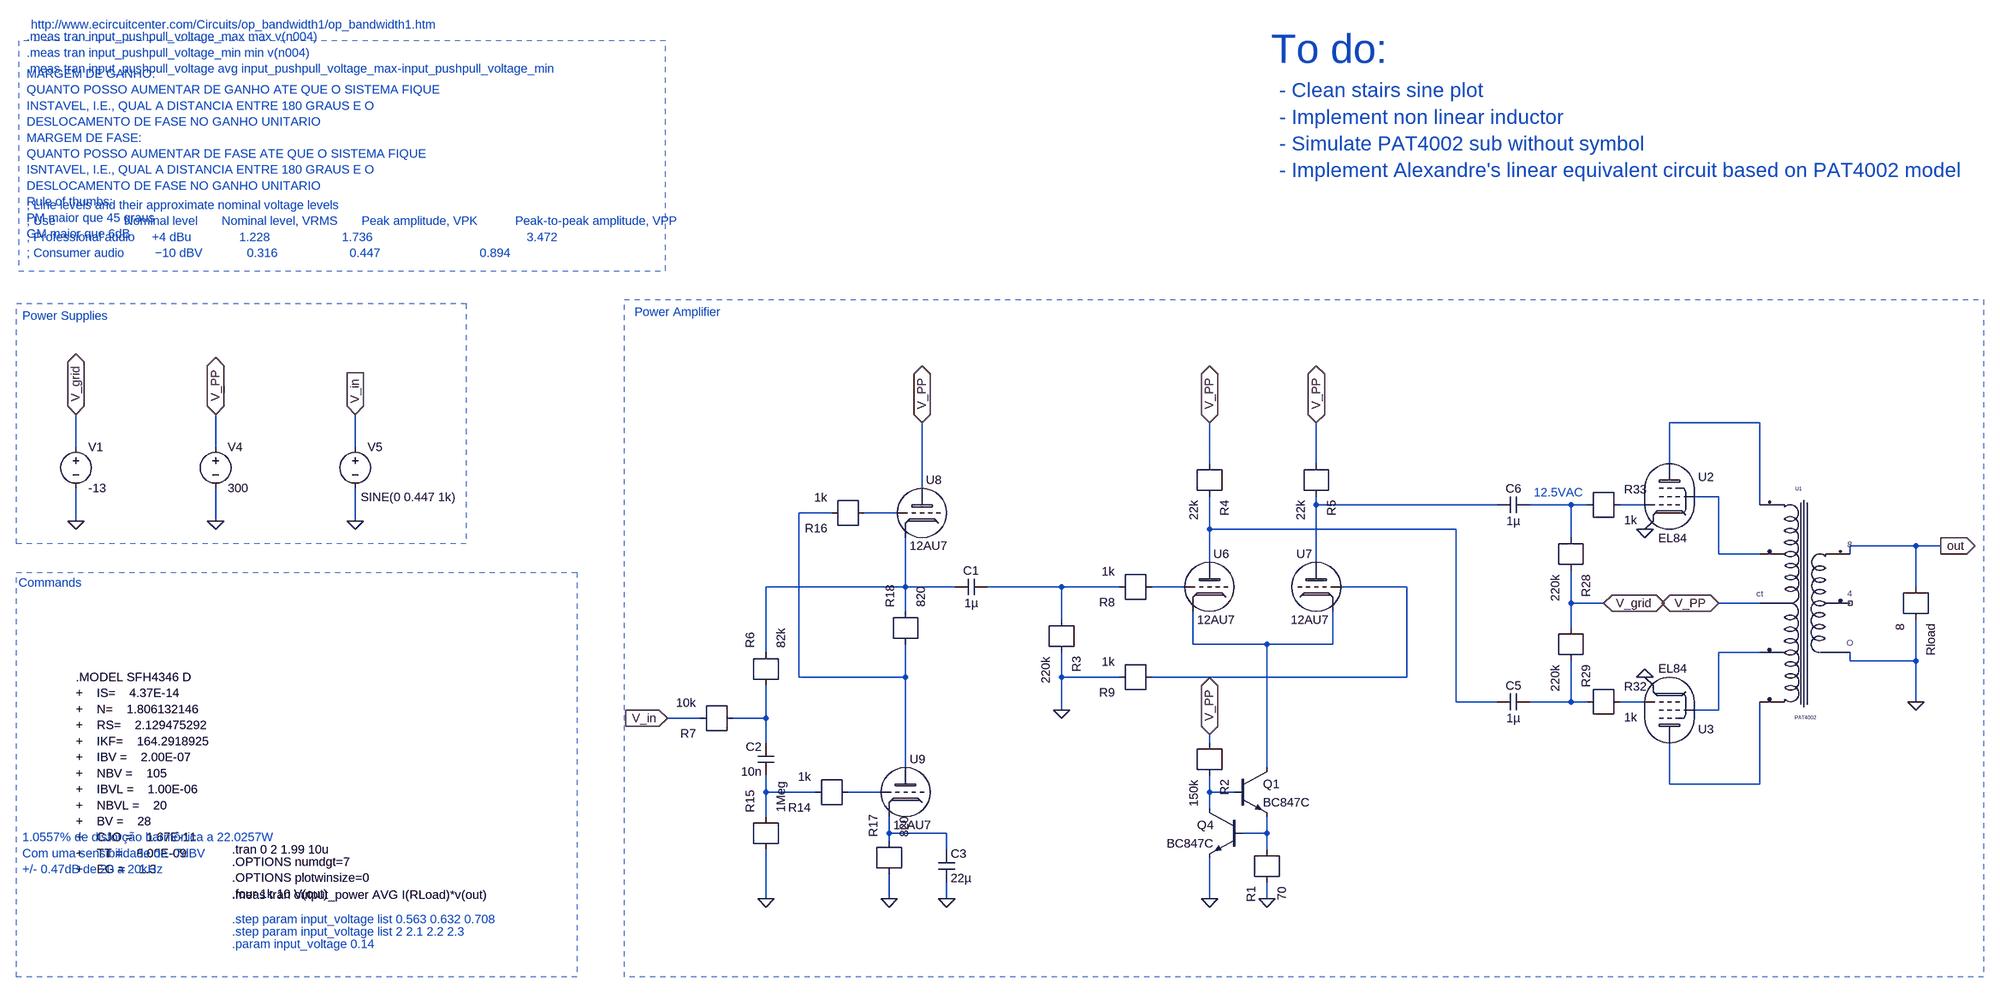
[diagram p0: schematic POWER_AMP_IC_rework_el84_transient_sine.asc]
POWER_AMP_IC_rework_el84_transient_sine.asc, the LTspice schematic file:
Version 4
SHEET 1 2188 1388
WIRE 912 -1200 736 -1200
WIRE -2368 -1152 -2368 -1216
WIRE -2096 -1152 -2096 -1216
WIRE -1824 -1152 -1824 -1216
WIRE -160 -1120 -160 -1200
WIRE 48 -1120 48 -1200
WIRE 736 -1120 736 -1200
WIRE -720 -1072 -720 -1200
WIRE 832 -1056 784 -1056
WIRE 48 -1040 48 -1056
WIRE 400 -1040 48 -1040
WIRE 544 -1040 464 -1040
WIRE 576 -1040 544 -1040
WIRE 688 -1040 640 -1040
WIRE 912 -1040 912 -1200
WIRE -896 -1024 -960 -1024
WIRE -768 -1024 -832 -1024
WIRE -2368 -1008 -2368 -1072
WIRE -2096 -1008 -2096 -1072
WIRE -1824 -1008 -1824 -1072
WIRE -160 -992 -160 -1056
WIRE 320 -992 -160 -992
WIRE 544 -976 544 -1040
WIRE 1216 -960 1088 -960
WIRE 1264 -960 1216 -960
WIRE 832 -944 832 -1056
WIRE 912 -944 832 -944
WIRE 1088 -944 1088 -960
WIRE -160 -928 -160 -992
WIRE 48 -928 48 -1040
WIRE -752 -880 -752 -976
WIRE -752 -880 -1024 -880
WIRE -656 -880 -752 -880
WIRE -448 -880 -592 -880
WIRE -336 -880 -448 -880
WIRE -208 -880 -272 -880
WIRE 224 -880 96 -880
WIRE 1216 -880 1216 -960
WIRE 544 -848 544 -912
WIRE 608 -848 544 -848
WIRE 912 -848 832 -848
WIRE -752 -832 -752 -880
WIRE -448 -816 -448 -880
WIRE 544 -800 544 -848
WIRE -192 -768 -192 -832
WIRE -48 -768 -192 -768
WIRE 80 -768 80 -832
WIRE 80 -768 -48 -768
WIRE -1024 -752 -1024 -880
WIRE 912 -752 832 -752
WIRE 1088 -736 1088 -752
WIRE 1216 -736 1216 -816
WIRE 1216 -736 1088 -736
WIRE -960 -704 -960 -1024
WIRE -752 -704 -752 -768
WIRE -752 -704 -960 -704
WIRE -448 -704 -448 -752
WIRE -336 -704 -448 -704
WIRE 224 -704 224 -880
WIRE 224 -704 -272 -704
WIRE 320 -656 320 -992
WIRE 400 -656 320 -656
WIRE 544 -656 544 -736
WIRE 544 -656 464 -656
WIRE 576 -656 544 -656
WIRE 688 -656 640 -656
WIRE 1216 -656 1216 -736
WIRE -448 -640 -448 -704
WIRE 832 -640 832 -752
WIRE 832 -640 784 -640
WIRE -1152 -624 -1216 -624
WIRE -1024 -624 -1024 -688
WIRE -1024 -624 -1088 -624
WIRE -1024 -576 -1024 -624
WIRE -160 -576 -160 -592
WIRE -752 -528 -752 -704
WIRE -48 -528 -48 -768
WIRE 736 -496 736 -576
WIRE 912 -496 912 -656
WIRE 912 -496 736 -496
WIRE -1024 -480 -1024 -512
WIRE -928 -480 -1024 -480
WIRE -800 -480 -864 -480
WIRE -160 -480 -160 -512
WIRE -112 -480 -160 -480
WIRE -160 -448 -160 -480
WIRE -1024 -432 -1024 -480
WIRE -784 -400 -784 -432
WIRE -672 -400 -784 -400
WIRE -48 -400 -48 -432
WIRE -48 -400 -96 -400
WIRE -784 -384 -784 -400
WIRE -672 -368 -672 -400
WIRE -48 -368 -48 -400
WIRE -1024 -272 -1024 -368
WIRE -784 -272 -784 -320
WIRE -672 -272 -672 -304
WIRE -160 -272 -160 -352
WIRE -48 -272 -48 -304
FLAG -1824 -1008 0
FLAG -2096 -1008 0
FLAG -2368 -1008 0
FLAG -2368 -1216 V_grid
IOPIN -2368 -1216 BiDir
FLAG 688 -992 0
FLAG 688 -704 0
FLAG 608 -848 V_grid
IOPIN 608 -848 BiDir
FLAG 1216 -656 0
FLAG 1264 -960 out
IOPIN 1264 -960 Out
FLAG -2096 -1216 V_PP
IOPIN -2096 -1216 BiDir
FLAG 832 -848 V_PP
IOPIN 832 -848 BiDir
FLAG -448 -640 0
FLAG -1216 -624 V_in
IOPIN -1216 -624 In
FLAG -1024 -272 0
FLAG -784 -272 0
FLAG -48 -272 0
FLAG -160 -272 0
FLAG -160 -592 V_PP
IOPIN -160 -592 BiDir
FLAG 48 -1200 V_PP
IOPIN 48 -1200 BiDir
FLAG -160 -1200 V_PP
IOPIN -160 -1200 BiDir
FLAG -720 -1200 V_PP
IOPIN -720 -1200 BiDir
FLAG -672 -272 0
FLAG -1824 -1216 V_in
IOPIN -1824 -1216 In
SYMBOL voltage -2096 -1168 R0
SYMATTR InstName V4
SYMATTR Value 300
SYMBOL voltage -1824 -1168 R0
WINDOW 3 11 113 Left 2
SYMATTR Value SINE(0 0.447 1k)
SYMATTR InstName V5
SYMATTR Value2 AC 1
SYMBOL voltage -2368 -1168 R0
SYMATTR InstName V1
SYMATTR Value -13
SYMBOL r 544 -976 R90
SYMATTR InstName R28
SYMATTR Value 220k
SYMBOL r 544 -800 R90
SYMATTR InstName R29
SYMATTR Value 220k
SYMBOL r 576 -656 R0
SYMATTR InstName R32
SYMATTR Value 1k
SYMBOL r 576 -1040 R0
SYMATTR InstName R33
SYMATTR Value 1k
SYMBOL cap 464 -672 R90
WINDOW 0 0 32 VBottom 2
WINDOW 3 32 32 VTop 2
SYMATTR InstName C5
SYMATTR Value 1µ
SYMBOL cap 464 -1056 R90
WINDOW 0 0 32 VBottom 2
WINDOW 3 32 32 VTop 2
SYMATTR InstName C6
SYMATTR Value 1µ
SYMBOL r 1216 -880 R90
SYMATTR InstName Rload
SYMATTR Value 8
SYMBOL Trafos/PAT4002 992 -848 R0
SYMATTR InstName U1
SYMBOL Tubes/EL84 736 -1056 R0
SYMATTR InstName U2
SYMBOL Tubes/EL84 736 -640 M180
SYMATTR InstName U3
SYMBOL npn -112 -528 R0
SYMATTR InstName Q1
SYMATTR Value BC847C
SYMBOL npn -96 -448 M0
SYMATTR InstName Q4
SYMATTR Value BC847C
SYMBOL r -48 -368 M90
SYMATTR InstName R1
SYMATTR Value 70
SYMBOL r -160 -576 R90
SYMATTR InstName R2
SYMATTR Value 150k
SYMBOL r -448 -816 R90
SYMATTR InstName R3
SYMATTR Value 220k
SYMBOL r -160 -1120 R90
SYMATTR InstName R4
SYMATTR Value 22k
SYMBOL r 48 -1120 R90
SYMATTR InstName R5
SYMATTR Value 22k
SYMBOL 12AU7 -160 -880 R0
SYMATTR InstName U6
SYMBOL 12AU7 48 -880 M0
SYMATTR InstName U7
SYMBOL cap -592 -896 R90
WINDOW 0 0 32 VBottom 2
WINDOW 3 32 32 VTop 2
SYMATTR InstName C1
SYMATTR Value 1µ
SYMBOL r -272 -880 R180
SYMATTR InstName R8
SYMATTR Value 1k
SYMBOL r -272 -704 R180
SYMATTR InstName R9
SYMATTR Value 1k
SYMBOL r -864 -480 R180
SYMATTR InstName R14
SYMATTR Value 1k
SYMBOL r -1024 -368 R270
SYMATTR InstName R15
SYMATTR Value 1Meg
SYMBOL r -832 -1024 R180
SYMATTR InstName R16
SYMATTR Value 1k
SYMBOL r -784 -320 R270
SYMATTR InstName R17
SYMATTR Value 820
SYMBOL r -752 -768 R270
SYMATTR InstName R18
SYMATTR Value 820
SYMBOL 12AU7 -720 -1024 R0
SYMATTR InstName U8
SYMBOL 12AU7 -752 -480 R0
SYMATTR InstName U9
SYMBOL r -1024 -688 R270
SYMATTR InstName R6
SYMATTR Value 82k
SYMBOL cap -1008 -576 M0
SYMATTR InstName C2
SYMATTR Value 10n
SYMBOL r -1088 -624 R180
SYMATTR InstName R7
SYMATTR Value 10k
SYMBOL cap -688 -368 R0
SYMATTR InstName C3
SYMATTR Value 22µ
TEXT -2064 -344 Left 2 !.OPTIONS numdgt=7\n.OPTIONS plotwinsize=0\n.four 1k 10 V(out)
TEXT -2368 -704 Left 2 !.MODEL SFH4346 D	\n+	IS=	4.37E-14\n+	N=	1.806132146\n+	RS=	2.129475292\n+	IKF=	164.2918925\n+	IBV =	2.00E-07\n+	NBV =	105\n+	IBVL =	1.00E-06\n+	NBVL =	20\n+	BV =	28\n+	CJO =	1.67E-11\n+	TT =	8.00E-09\n+	EG =	1.3
TEXT -2480 -888 Left 2 ;Commands
TEXT -2472 -1408 Left 2 ;Power Supplies
TEXT -2464 -1880 Left 2 ;MARGEM DE GANHO:\nQUANTO POSSO AUMENTAR DE GANHO ATE QUE O SISTEMA FIQUE\nINSTAVEL, I.E., QUAL A DISTANCIA ENTRE 180 GRAUS E O \nDESLOCAMENTO DE FASE NO GANHO UNITARIO\nMARGEM DE FASE:\nQUANTO POSSO AUMENTAR DE FASE ATE QUE O SISTEMA FIQUE \nISNTAVEL, I.E., QUAL A DISTANCIA ENTRE 180 GRAUS E O \nDESLOCAMENTO DE FASE NO GANHO UNITARIO\nRule of thumbs:\nPM maior que 45 graus\nGM maior que 6dB
TEXT -1280 -1416 Left 2 ;Power Amplifier
TEXT -2064 -280 Left 2 !.meas tran output_power AVG I(RLoad)*v(out)
TEXT -2064 -232 Left 2 ;.step param input_voltage list 0.563 0.632 0.708
TEXT -2472 -392 Left 2 ;1.0557% de distorção harmônica a 22.0257W\nCom uma sensibilidade de -7dBV\n+/- 0.47dB de 20 a 20kHz
TEXT -2064 -208 Left 2 ;.step param input_voltage list 2 2.1 2.2 2.3
TEXT -2064 -184 Left 2 ;.param input_voltage 0.14
TEXT -2464 -1624 Left 2 ;; Line levels and their approximate nominal voltage levels\n; Use                	Nominal level   	Nominal level, VRMS   	Peak amplitude, VPK   		Peak-to-peak amplitude, VPP\n; Professional audio 	+4 dBu          	1.228                 	1.736                 							3.472\n; Consumer audio     	−10 dBV         	0.316                 	0.447                 			0.894
TEXT -2464 -1952 Left 2 ;.meas tran input_pushpull_voltage_max max v(n004)\n.meas tran input_pushpull_voltage_min min v(n004)\n.meas tran input_pushpull_voltage avg input_pushpull_voltage_max-input_pushpull_voltage_min
TEXT 472 -1064 Left 2 ;12.5VAC
TEXT -2456 -1976 Left 2 ;http://www.ecircuitcenter.com/Circuits/op_bandwidth1/op_bandwidth1.htm
TEXT -2064 -368 Left 2 !.tran 0 2 1.99 10u
TEXT -40 -1928 Left 6 ;To do:
TEXT -24 -1848 Left 4 ;- Clean stairs sine plot\n- Implement non linear inductor\n- Simulate PAT4002 sub without symbol\n- Implement Alexandre's linear equivalent circuit based on PAT4002 model
RECTANGLE Normal -2484 -908 -1392 -120 2
RECTANGLE Normal -2484 -1432 -1608 -964 2
RECTANGLE Normal -1300 -1440 1348 -120 2
RECTANGLE Normal -2480 -1496 -1220 -1944 2

The netlist it stands for:
* POWER_AMP_IC_rework_el84_transient_sine.asc
V4 V_PP 0 300
V5 V_in 0 SINE(0 0.447 1k) AC 1
V1 V_grid 0 -13
R28 V_grid N004 220k
R29 N015 V_grid 220k
R32 N016 N015 1k
R33 N005 N004 1k
C5 N015 N008 1µ
C6 N004 N003 1µ
Rload 0 out 8
XU1 N001 N002 V_PP N014 N018 out NC_01 0 PAT4002  ; pins p1 st1 ct st2 p2 8 4 O
XU2 N001 N002 N005 0 EL84  ; pins Placa Grade_Screen Grade_controle Câtodo
XU3 N018 N014 N016 0 EL84  ; pins Placa Grade_Screen Grade_controle Câtodo
Q1 N013 N021 N023 0 BC847C
Q4 N021 N023 0 0 BC847C
R1 0 N023 70
R2 N021 V_PP 150k
R3 0 N010 220k
R4 N008 V_PP 22k
R5 N003 V_PP 22k
XU6 N008 N011 N013 12AU7  ; pins Plate Grid Cathode
XU7 N003 N012 N013 12AU7  ; pins Plate Grid Cathode
C1 N010 N009 1µ
R8 N010 N011 1k
R9 0 N012 1k
R14 N019 N020 1k
R15 N019 0 1Meg
R16 N006 N007 1k
R17 N022 0 820
R18 N009 N006 820
XU8 V_PP N007 N009 12AU7  ; pins Plate Grid Cathode
XU9 N006 N020 N022 12AU7  ; pins Plate Grid Cathode
R6 N009 N017 82k
C2 N017 N019 10n
R7 V_in N017 10k
C3 N022 0 22µ
.model NPN NPN
.model PNP PNP
.lib standard.bjt
.OPTIONS numdgt=7
.OPTIONS plotwinsize=0
.four 1k 10 V(out)
.MODEL SFH4346 D
+	IS=	4.37E-14
+	N=	1.806132146
+	RS=	2.129475292
+	IKF=	164.2918925
+	IBV =	2.00E-07
+	NBV =	105
+	IBVL =	1.00E-06
+	NBVL =	20
+	BV =	28
+	CJO =	1.67E-11
+	TT =	8.00E-09
+	EG =	1.3
* Commands
* Power Supplies
* MARGEM DE GANHO:
* QUANTO POSSO AUMENTAR DE GANHO ATE QUE O SISTEMA FIQUE
* INSTAVEL, I.E., QUAL A DISTANCIA ENTRE 180 GRAUS E O
* DESLOCAMENTO DE FASE NO GANHO UNITARIO
* MARGEM DE FASE:
* QUANTO POSSO AUMENTAR DE FASE ATE QUE O SISTEMA FIQUE
* ISNTAVEL, I.E., QUAL A DISTANCIA ENTRE 180 GRAUS E O
* DESLOCAMENTO DE FASE NO GANHO UNITARIO
* Rule of thumbs:
* PM maior que 45 graus
* GM maior que 6dB
* Power Amplifier
.meas tran output_power AVG I(RLoad)*v(out)
* .step param input_voltage list 0.563 0.632 0.708
* 1.0557% de distorção harmônica a 22.0257W
* Com uma sensibilidade de -7dBV
* +/- 0.47dB de 20 a 20kHz
* .step param input_voltage list 2 2.1 2.2 2.3
* .param input_voltage 0.14
* ; Line levels and their approximate nominal voltage levels
* ; Use                	Nominal level   	Nominal level, VRMS   	Peak amplitude, VPK   		Peak-to-peak amplitude, VPP
* ; Professional audio 	+4 dBu          	1.228                 	1.736                 							3.472
* ; Consumer audio     	−10 dBV         	0.316                 	0.447                 			0.894
* .meas tran input_pushpull_voltage_max max v(n004)
* .meas tran input_pushpull_voltage_min min v(n004)
* .meas tran input_pushpull_voltage avg input_pushpull_voltage_max-input_pushpull_voltage_min
* 12.5VAC
* http://www.ecircuitcenter.com/Circuits/op_bandwidth1/op_bandwidth1.htm
.tran 0 2 1.99 10u
* To do:
* - Clean stairs sine plot
* - Implement non linear inductor
* - Simulate PAT4002 sub without symbol
* - Implement Alexandre's linear equivalent circuit based on PAT4002 model
.lib trafos.lib
.lib tubes.lib
.lib tube.lib
.backanno
.end